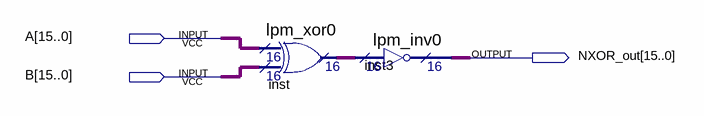
[diagram p0: schematic sheet]
// Quartus schematic logic_NXOR.bdf as structural Verilog: 2 symbols, 3 pins
module logic_NXOR (
  input  [15:0] A,
  input  [15:0] B,
  output [15:0] NXOR_out
);

  wire [15:0] inst_result;

  lpm_xor0 inst (.data0x(A), .data1x(B), .result(inst_result));
  lpm_inv0 inst3 (.data(inst_result), .result(NXOR_out));
endmodule
